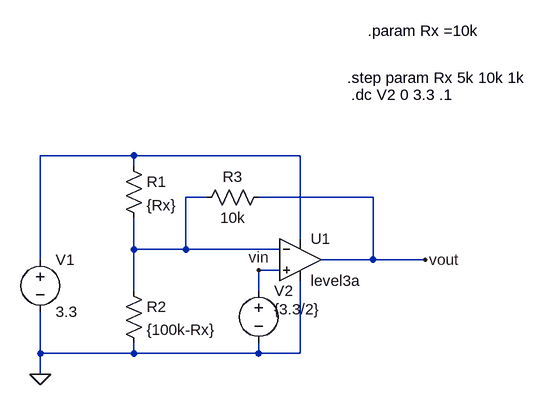
[diagram p0: schematic Draft1.asc]
Draft1.asc, the LTspice schematic file:
Version 4
SHEET 1 880 680
WIRE -80 32 -224 32
WIRE 176 32 -80 32
WIRE -80 48 -80 32
WIRE 32 96 0 96
WIRE 288 96 112 96
WIRE 176 160 176 32
WIRE -80 176 -80 128
WIRE 0 176 0 96
WIRE 0 176 -80 176
WIRE 144 176 0 176
WIRE -224 192 -224 32
WIRE 288 192 288 96
WIRE 288 192 208 192
WIRE 368 192 288 192
WIRE 144 208 112 208
WIRE -80 240 -80 176
WIRE 112 240 112 208
WIRE -224 336 -224 272
WIRE -80 336 -80 320
WIRE -80 336 -224 336
WIRE 112 336 112 320
WIRE 112 336 -80 336
WIRE 176 336 176 224
WIRE 176 336 112 336
WIRE -224 368 -224 336
FLAG 368 192 vout
FLAG 112 208 vin
FLAG -224 368 0
SYMBOL OpAmps\\UniversalOpAmp3 176 192 R0
SYMATTR InstName U1
SYMBOL voltage -224 176 R0
WINDOW 123 0 0 Left 0
WINDOW 39 0 0 Left 0
SYMATTR InstName V1
SYMATTR Value 3.3
SYMBOL res -96 32 R0
SYMATTR InstName R1
SYMATTR Value {Rx}
SYMBOL res -96 224 R0
SYMATTR InstName R2
SYMATTR Value {100k-Rx}
SYMBOL res 128 80 R90
WINDOW 0 0 56 VBottom 2
WINDOW 3 32 56 VTop 2
SYMATTR InstName R3
SYMATTR Value 10k
SYMBOL voltage 112 224 R0
WINDOW 3 24 44 Left 2
WINDOW 123 0 0 Left 0
WINDOW 39 0 0 Left 0
SYMATTR InstName V2
SYMATTR Value {3.3/2}
TEXT 248 -88 Left 2 !.step param Rx 5k 10k 1k
TEXT 254 -62 Left 2 !.dc V2 0 3.3 .1
TEXT 280 -160 Left 2 !.param Rx =10k

The netlist it stands for:
* Draft1.asc
XU1 vin N002 N001 0 vout level3a  ; pins In+ In- V+ V- OUT
V1 N001 0 3.3
R1 N001 N002 {Rx}
R2 N002 0 {100k-Rx}
R3 vout N002 10k
V2 vin 0 {3.3/2}
.step param Rx 5k 10k 1k
.dc V2 0 3.3 .1
.param Rx =10k
.backanno
.end